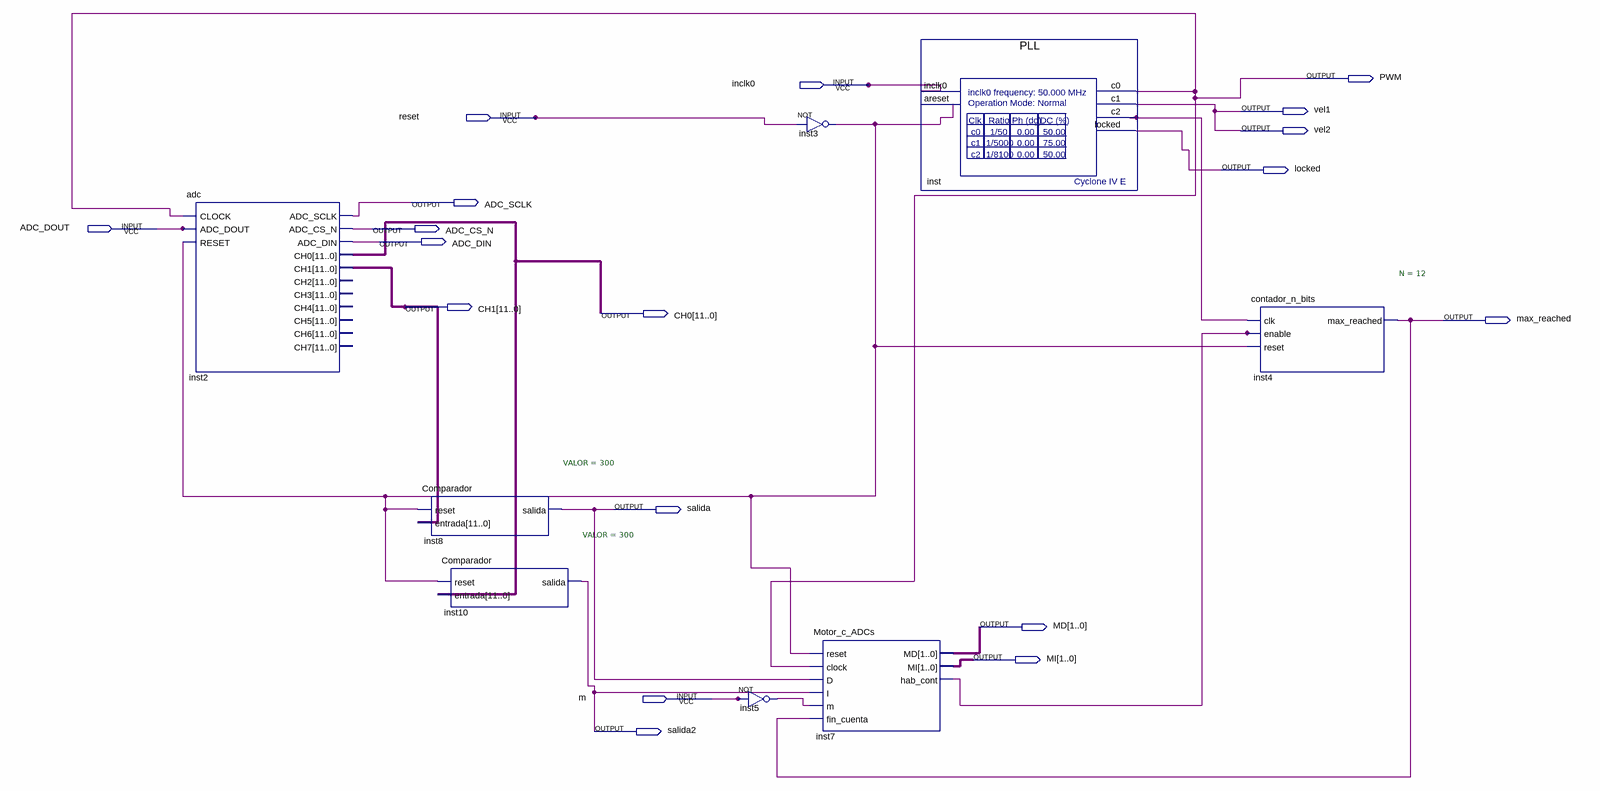
[diagram p0: schematic sheet]
// Quartus schematic Control_Motor.bdf as structural Verilog: 8 symbols, 18 pins
module Control_Motor (
  input  inclk0,
  input  reset,
  input  ADC_DOUT,
  input  m,
  output PWM,
  output vel1,
  output vel2,
  output locked,
  output ADC_SCLK,
  output ADC_CS_N,
  output ADC_DIN,
  output [11:0] CH1,
  output [11:0] CH0,
  output max_reached,
  output salida,
  output [1:0] MD,
  output [1:0] MI,
  output salida2
);

  wire inst3_out, inst5_out, inst7_hab_cont, inst_c2;

  adc inst2 (
    .CLOCK(PWM), .ADC_DOUT(ADC_DOUT), .RESET(inst3_out), .ADC_SCLK(ADC_SCLK), .ADC_CS_N(ADC_CS_N),
    .ADC_DIN(ADC_DIN), .CH0(CH0), .CH1(CH1));  // open: CH2, CH3, CH4, CH5, CH6, CH7
  Comparador #(.VALOR(300)) inst8 (.reset(inst3_out), .entrada(CH1), .salida(salida));
  Comparador #(.VALOR(300)) inst10 (.reset(inst3_out), .entrada(CH0), .salida(salida2));
  not inst5 (inst5_out, m);
  not inst3 (inst3_out, reset);
  Motor_c_ADCs inst7 (
    .reset(inst3_out), .clock(PWM), .D(salida), .I(salida2), .m(inst5_out), .fin_cuenta(max_reached),
    .MD(MD), .MI(MI), .hab_cont(inst7_hab_cont));
  PLL inst (.inclk0(inclk0), .areset(inst3_out), .c0(PWM), .c1(vel1), .c2(inst_c2), .locked(locked));
  contador_n_bits #(.N(12)) inst4 (
    .clk(inst_c2), .enable(inst7_hab_cont), .reset(inst3_out), .max_reached(max_reached));

  assign vel2 = vel1;
endmodule
